# Altium schematic sheet Power_Supply.SchDoc
size A4; SheetNumber: 3; SheetTotal: 5
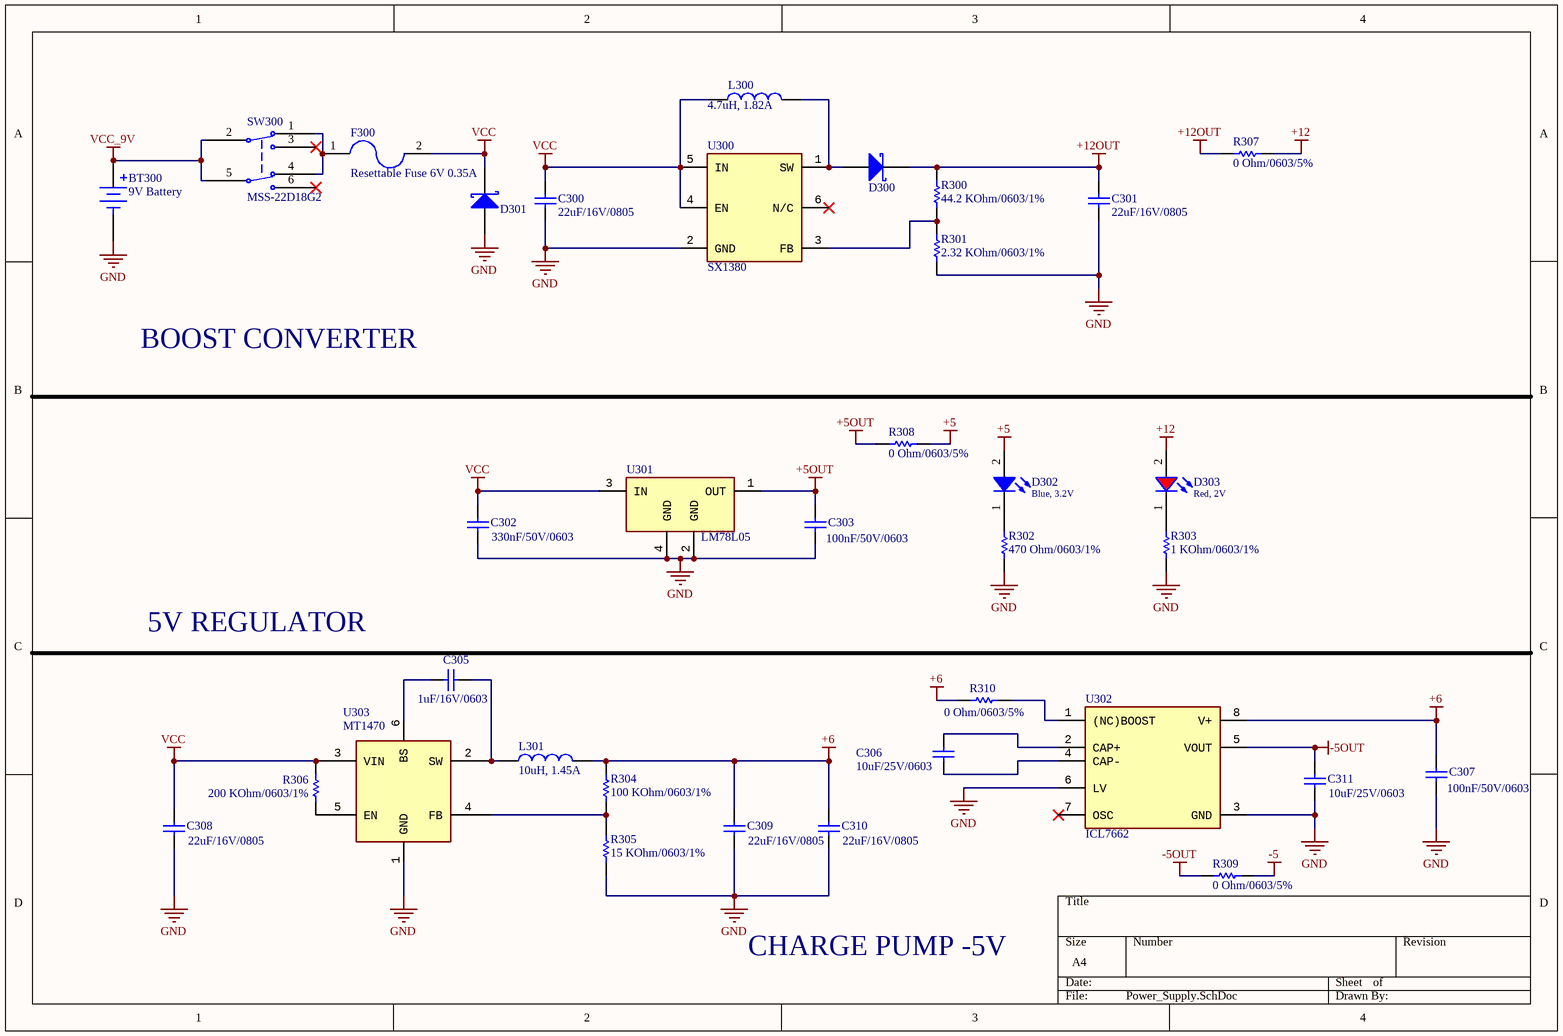
[diagram p0: Power_Supply.SchDoc]

## Parts
BT300  value 9V Battery  [BAT_BC9VPC]  (hidden comment: BC9VPC)
C300  value 22uF/16V/0805  [CAP-SM-0805]  (hidden comment: Cap Non-Pol SMD)
C301  value 22uF/16V/0805  [CAP-SM-0805]  (hidden comment: Cap Non-Pol SMD)
C302  value 330nF/50V/0603  [WCAP-CSGP_0603_H=0.8mm_Reflow]  (hidden comment: 330nF, 50V)
C303  value 100nF/50V/0603  [WCAP-CSGP_0603_H=0.8mm_Reflow]  (hidden comment: 100nF, 25V)
C305  value 1uF/16V/0603  [WCAP-CSGP_0603_H=0.8mm_Reflow]  (hidden comment: 1uF, 16V)
C306  value 10uF/25V/0603  [WCAP-CSGP_0603_H=0.8mm_Reflow]  (hidden comment: 10uF, 6.3V)
C307  value 100nF/50V/0603  [WCAP-CSGP_0603_H=0.8mm_Reflow]  (hidden comment: 100nF, 25V)
C308  value 22uF/16V/0805  [WCAP-CSGP_0805_H=1.25mm]  (hidden comment: 22uF, 10V)
C309  value 22uF/16V/0805  [WCAP-CSGP_0805_H=1.25mm]  (hidden comment: 22uF, 10V)
C310  value 22uF/16V/0805  [WCAP-CSGP_0805_H=1.25mm]  (hidden comment: 22uF, 10V)
C311  value 10uF/25V/0603  [WCAP-CSGP_0603_H=0.8mm_Reflow]  (hidden comment: 10uF, 6.3V)
D300  D Schottky  [SS34]  (value not drawn)
D301  D Schottky  [SS34]  (value not drawn)
D302  Blue, 3.2V  [WL-SMCW_0603_H=0.7mm]
D303  Red, 2V  [WL-SMCW_0603_H=0.7mm]
F300  value Resettable Fuse 6V 0.35A  [FUSE1206]  (hidden comment: RESETTABLE FUSE 1206)
L300  4.7uH, 1.82A  [WE-PD2A_4532]
L301  10uH, 1.45A  [WE-PD2A_4532]
R300  value 44.2 KOhm/0603/1%  [R0603]  (hidden comment: Resistor 44.2 KOhm 0603 1%)
R301  value 2.32 KOhm/0603/1%  [R0603]  (hidden comment: Resistor 2.32 KOhm 0603 1%)
R302  value 470 Ohm/0603/1%  [R0603]  (hidden comment: Resistor 470 Ohm 0603 1%)
R303  value 1 KOhm/0603/1%  [R0603]  (hidden comment: Resistor 1 KOhm 0603 1%)
R304  value 100 KOhm/0603/1%  [R0603]  (hidden comment: Resistor 100 KOhm 0603 1%)
R305  value 15 KOhm/0603/1%  [R0603]  (hidden comment: Resistor 15 KOhm 0603 1%)
R306  value 200 KOhm/0603/1%  [R0603]  (hidden comment: Resistor 200 KOhm 0603 5%)
R307  value 0 Ohm/0603/5%  [R0603]  (hidden comment: Resistor 0 Ohm 0603 5%)
R308  value 0 Ohm/0603/5%  [R0603]  (hidden comment: Resistor 0 Ohm 0603 5%)
R309  value 0 Ohm/0603/5%  [R0603]  (hidden comment: Resistor 0 Ohm 0603 5%)
R310  value 0 Ohm/0603/5%  [R0603]  (hidden comment: Resistor 0 Ohm 0603 5%)
SW300  value MSS-22D18G2  [MSS-22D18G2]  (hidden comment: Slide Switch)
U300  value SX1380  [SOT-23-6]  (hidden comment: SX1308)
U301  value LM78L05  [SOT-89]  (hidden comment: 78L05)
U302  value ICL7662  [SOIC-8]  (hidden comment: ICL7662EBA+)
U303  MT1470  [SOT-23-6]

## Nets
+5: D302.2(A) R308.2
+5OUT: C303.1 R308.1 U301.1(OUT)
+6: C307.1 C309.2 C310.2 L301.2 R304.2 R310.1 U302.8(V+)
+12: D303.2(A) R307.2
+12OUT: C301.2 D300.2(K) R300.2 R307.1
-5: R309.2
-5OUT: C311.2 R309.1 U302.5(VOUT)
GND: BT300.N(NEG) C300.1 C301.1 C302.1 C303.2 C307.2 C308.1 C309.1 C310.1 C311.1 D301.1(A) R301.1 R302.1 R303.1 R305.1 U300.2(GND) U301.2(GND) U301.4(GND) U302.3(GND) U302.6(LV) U303.1(GND)
VCC: C300.2 C302.2 C308.2 D301.2(K) F300.2 L300.1 R306.2 U300.4(EN) U300.5(IN) U301.3(IN) U303.3(VIN)
VCC_9V: BT300.P(POS) SW300.2 SW300.5
NetC305_1: C305.1 U303.6(BS)
NetC305_2: C305.2 L301.1 U303.2(SW)
NetC306_1: C306.1 U302.4(CAP-)
NetC306_2: C306.2 U302.2(CAP+)
NetD300_1: D300.1(A) L300.2 U300.1(SW)
NetD302_1: D302.1(K) R302.2
NetD303_1: D303.1(K) R303.2
NetF300_1: F300.1 SW300.1 SW300.4
NetR300_1: R300.1 R301.2 U300.3(FB)
NetR304_1: R304.1 R305.2 U303.4(FB)
NetR306_1: R306.1 U303.5(EN)
NetR310_2: R310.2 U302.1((NC)BOOST)

Not connected (* = marked no-connect by the designer): SW300 3(13)* 6(15)*; U300 6(N/C)*; U302 7(OSC)*

## Notes on the sheet
- BOOST CONVERTER
- 5V REGULATOR
- CHARGE PUMP -5V

## Library data of the parts
BT300 = BC9VPC: Battery Holder 1 Cells 9V Size Plastic Tray; MF: MPD (Memory Protection Devices); SnapEDA_Link: https://www.snapeda.com/parts/BC9VPC/Memory+Protection+Devices/view-part/?ref=snap; Package: None; MP: BC9VPC; Check_prices: https://www.snapeda.com/parts/BC9VPC/Memory+Protection+Devices/view-part/?ref=eda
C300 C301 = Cap Non-Pol SMD: Capacitor
C302 = 885012206121: WCAP-CSGP Multilayer Ceramic Chip Capacitor, General Purpose, size 0603, X7R, 330nF, 50V; Manufacturer: Wurth Elektronik; Rated Voltage: 50VDC; Isolation Resistance: >=1.5GOhm; Capacitance Tolerance: +/-10%; Technical Reference: X7R0603334K050DFCT10000; ComponentLink1Description: Manufacturer; ComponentLink1URL: http://www.we-online.de; ComponentLink2Description: Datasheet; ComponentLink2URL: https://www.we-online.com/catalog/datasheet/885012206121.pdf; Operating Temperature: -55 to +125degC; Packaging: Tape and Reel; Manufacturer Part Number: 885012206121; Published Date: May 2020; Ceramic Type: X7R; Dissipation Factor: =<10%; Height: 0.8mm; Mounting Technology: SMT; Size: 0603
C303 C307 = 885012206071: WCAP-CSGP Multilayer Ceramic Chip Capacitor, General Purpose, size 0603, X7R, 100nF, 25V; Manufacturer: Wurth Elektronik; Rated Voltage: 25VDC; Isolation Resistance: >=5GOhm; Capacitance Tolerance: +/-10%; Technical Reference: X7R0603104K025DFCT10000; ComponentLink1Description: Manufacturer; ComponentLink1URL: http://www.we-online.de; ComponentLink2Description: Datasheet; ComponentLink2URL: https://www.we-online.com/catalog/datasheet/885012206071.pdf; Operating Temperature: -55 to +125degC; Packaging: Tape and Reel; Manufacturer Part Number: 885012206071; Published Date: May 2020; Ceramic Type: X7R; Dissipation Factor: =<3.5%; Height: 0.8mm; Mounting Technology: SMT; Size: 0603
C305 = 885012106017: WCAP-CSGP Multilayer Ceramic Chip Capacitor, General Purpose, size 0603, X5R, 1uF, 16V; Manufacturer: Wurth Elektronik; Rated Voltage: 16VDC; Isolation Resistance: >=0.1GOhm; Capacitance Tolerance: +/-20%; Technical Reference: X5R0603105M016DFCT10000; ComponentLink1Description: Manufacturer; ComponentLink1URL: http://www.we-online.de; ComponentLink2Description: Datasheet; ComponentLink2URL: https://www.we-online.com/catalog/datasheet/885012106017.pdf; Operating Temperature: -55 to +85degC; Packaging: Tape and Reel; Manufacturer Part Number: 885012106017; Published Date: May 2020; Ceramic Type: X5R; Dissipation Factor: =<10%; Height: 0.8mm; Mounting Technology: SMT; Size: 0603
C306 C311 = 885012106006: WCAP-CSGP Multilayer Ceramic Chip Capacitor, General Purpose, size 0603, X5R, 10uF, 6.3V; Manufacturer: Wurth Elektronik; Rated Voltage: 6.3VDC; Isolation Resistance: >=0.01GOhm; Capacitance Tolerance: +/-20%; Technical Reference: X5R0603106M6R3DFCT10000; ComponentLink1Description: Manufacturer; ComponentLink1URL: http://www.we-online.de; ComponentLink2Description: Datasheet; ComponentLink2URL: https://www.we-online.com/catalog/datasheet/885012106006.pdf; Operating Temperature: -55 to +85degC; Packaging: Tape and Reel; Manufacturer Part Number: 885012106006; Published Date: May 2020; Ceramic Type: X5R; Dissipation Factor: =<10%; Height: 0.8mm; Mounting Technology: SMT; Size: 0603
C308-C310 = 885012107011: WCAP-CSGP Multilayer Ceramic Chip Capacitor, General Purpose, size 0805, X5R, 22uF, 10V; Manufacturer: Wurth Elektronik; Rated Voltage: 10VDC; Isolation Resistance: >=0.005GOhm; Capacitance Tolerance: +/-20%; Technical Reference: X5R0805226M010DFCT10000; ComponentLink1Description: Manufacturer; ComponentLink1URL: http://www.we-online.de; ComponentLink2Description: Datasheet; ComponentLink2URL: https://www.we-online.com/catalog/datasheet/885012107011.pdf; Operating Temperature: -55 to +85degC; Packaging: Tape and Reel; Manufacturer Part Number: 885012107011; Published Date: May 2020; Ceramic Type: X5R; Dissipation Factor: =<10%; Height: 1.25mm; Mounting Technology: SMT; Size: 0805
D300 D301 = D Schottky: Schottky Diode; Published: 8-Jun-2000; LatestRevisionDate: 17-Jul-2002; LatestRevisionNote: Re-released for DXP Platform.; PackageReference: SMB; Publisher: Altium Limited; PackageDescription: DO-214-AA/SMB; 2 C-Bend Leads; Body 5.3 x 3.6 mm, inc. leads (LxW); Code_JEDEC: DO-214-AA
D302 = 150060BS75000: WL-SMCW SMT Mono-color Chip LED Waterclear, size 0603, Blue, 3.2V, 140deg; Chip Technology: InGaN; Dominant Wavelength typ.: 470nm; Luminous Intensity typ.: 145mcd; Peak Wavelength typ.: 465nm; Viewing Angle: 140deg; ComponentLink1Description: Manufacturer; ComponentLink1URL: http://www.we-online.de; ComponentLink2URL: https://www.we-online.com/catalog/datasheet/150060BS75000.pdf; ComponentLink2Description: Datasheet; Forward Voltage typ.: 3.2V; Emitting Color: Blue; Mounting Technology: SMT; Operating Temperature: -40 to +85degC; Published Date: December 2019; Part Number: 150060BS75000; Packaging: Tape and Reel; Size: 0603; Publisher: Wurth Elektronik
D303 = 150060RS75000: WL-SMCW SMT Mono-color Chip LED Waterclear, size 0603, Red, 2V, 140deg; Chip Technology: AlInGaP; Dominant Wavelength typ.: 625nm; Luminous Intensity typ.: 250mcd; Peak Wavelength typ.: 630nm; Viewing Angle: 140deg; ComponentLink1Description: Manufacturer; ComponentLink1URL: http://www.we-online.de; ComponentLink2URL: https://www.we-online.com/catalog/datasheet/150060RS75000.pdf; ComponentLink2Description: Datasheet; Forward Voltage typ.: 2V; Emitting Color: Red; Mounting Technology: SMT; Operating Temperature: -40 to +85degC; Published Date: December 2019; Part Number: 150060RS75000; Packaging: Tape and Reel; Size: 0603; Publisher: Wurth Elektronik
F300 = RESETTABLE FUSE 1206: Polymeric PTC Resettable Fuse 6V 350mA Ih Surface Mount 1206 _3216 Metric_, Concave; MF: Littelfuse Inc.; MP: 1206L035YR; Package: 1206 Littelfuse; Price: None; Availability: Unavailable; SnapEDA_Link: https://www.snapeda.com/parts/1206L035YR/Littelfuse%20Inc./view-part/225191/?ref=snap
L300 = 784773047: WE-PD2A SMT Power Inductor, size 4532, 4.7uH, 1.82A; Manufacturer: Wurth Elektronik; DC Resistance max.: 0.11Ohm; Saturation Current: 2.46A; Self Resonant Frequency: 45MHz; DC Resistance typ.: 0.059Ohm; Rated Voltage: 80VDC; ComponentLink1Description: Manufacturer; ComponentLink1URL: http://www.we-online.de; ComponentLink2Description: Datasheet; ComponentLink2URL: https://www.we-online.com/catalog/datasheet/784773047.pdf; Manufacturer Part Number: 784773047; Published Date: May 2020; Rated Current: 1.82A; Value: 4.7uH, 1.82A; Operating Temperature: -40 to +125degC; Mounting Technology: SMT; Packaging: Tape and Reel; Size: 4532
L301 = 78477310: WE-PD2A SMT Power Inductor, size 4532, 10uH, 1.45A; Manufacturer: Wurth Elektronik; DC Resistance max.: 0.182Ohm; Saturation Current: 1.74A; Self Resonant Frequency: 30MHz; DC Resistance typ.: 0.118Ohm; Rated Voltage: 80VDC; ComponentLink1Description: Manufacturer; ComponentLink1URL: http://www.we-online.de; ComponentLink2Description: Datasheet; ComponentLink2URL: https://www.we-online.com/catalog/datasheet/78477310.pdf; Manufacturer Part Number: 78477310; Published Date: May 2020; Rated Current: 1.45A; Inductance: 10uH; Operating Temperature: -40 to +125degC; Mounting Technology: SMT; Packaging: Tape and Reel; Size: 4532
R300 = Resistor 44.2 KOhm 0603 1%: Code (4422, 63C), 1/10W 1%; ComponentLink1Description: Buy; ComponentLink1URL: https://www.thegioiic.com/dien-tro-44-2-kohm-0603-1-
R301 = Resistor 2.32 KOhm 0603 1%: Code (2321, 36B), 1/10W; ComponentLink1Description: Buy; ComponentLink1URL: https://www.thegioiic.com/dien-tro-2-7-kohm-0603-5-
R302 = Resistor 470 Ohm 0603 1%: Code 471, 1/10W; ComponentLink1Description: Buy; ComponentLink1URL: https://www.thegioiic.com/dien-tro-470-ohm-0603-1-
R303 = Resistor 1 KOhm 0603 1%: Code 102, 1/10W; ComponentLink1Description: Buy; ComponentLink1URL: https://www.thegioiic.com/dien-tro-1-kohm-0603-1
R304 = Resistor 100 KOhm 0603 1%: Code 104, 1/10W; ComponentLink1Description: Buy; ComponentLink1URL: https://www.thegioiic.com/dien-tro-100-kohm-0603-1-
R305 = Resistor 15 KOhm 0603 1%: Code 153, 1/10W; ComponentLink1Description: Buy; ComponentLink1URL: https://www.thegioiic.com/dien-tro-15-kohm-0603-1-
R306 = Resistor 200 KOhm 0603 5%: Code 2003, 1/10W; ComponentLink1Description: Buy; ComponentLink1URL: https://www.thegioiic.com/dien-tro-200-kohm-0603-1-
R307-R310 = Resistor 0 Ohm 0603 5%: Code 0R, 1/10W; ComponentLink1Description: Buy; ComponentLink1URL: https://www.thegioiic.com/dien-tro-0-ohm-0603-5-
U300 = SX1308: High Efficiency 1.2MHz 2A Step Up Converter; MF: Semtech Corporation; Price: None; Purchase-URL: https://pricing.snapeda.com/search/part/SX1308/?ref=eda; Check_prices: https://www.snapeda.com/parts/SX1308/Semtech+Corporation/view-part/?ref=eda; SnapEDA_Link: https://www.snapeda.com/parts/SX1308/Semtech+Corporation/view-part/?ref=snap; Availability: In Stock; MP: SX1308; Package: - Semtech Corporation
U301 = 78L05: IC REG LINEAR 5V 100MA SOT89-3; MF: Hottech Co; Availability: Not in stock; Check_prices: https://www.snapeda.com/parts/78L05/Hottech+Semiconductor/view-part/?ref=eda; Package: None; Price: None; MP: 78L05; SnapEDA_Link: https://www.snapeda.com/parts/78L05/Hottech+Semiconductor/view-part/?ref=snap
U302 = ICL7662EBA+: CMOS, Voltage Converters; MF: Analog Devices; Purchase-URL: https://pricing.snapeda.com/search/part/ICL7662EBA+/?ref=eda; MP: ICL7662EBA+; Availability: In Stock; Check_prices: https://www.snapeda.com/parts/ICL7662EBA+/Analog+Devices/view-part/?ref=eda; SnapEDA_Link: https://www.snapeda.com/parts/ICL7662EBA+/Analog+Devices/view-part/?ref=snap; Price: None; Package: SOIC-8 Maxim; ComponentLink1Description: Buy; ComponentLink1URL: https://www.thegioiic.com/icl7662cba
U303 = MT1470: 2A, 4.5 - 18V Input, 500kHz Synchronous Step-Down Converter; ComponentLink1Description: Buy; ComponentLink1URL: https://www.thegioiic.com/mt1470-ic-dieu-chinh-giam-ap-2a-sot-23-6; Value: MT1470
SW300 = Slide Switch: ComponentLink1Description: Buy; ComponentLink1URL: https://www.thegioiic.com/mss-22d18g2-cong-tac-truot-6-chan-smd-2p2t